# Altium schematic sheet ADC-Filter.SchDoc
size A4; SheetNumber: 12; SheetTotal: 12
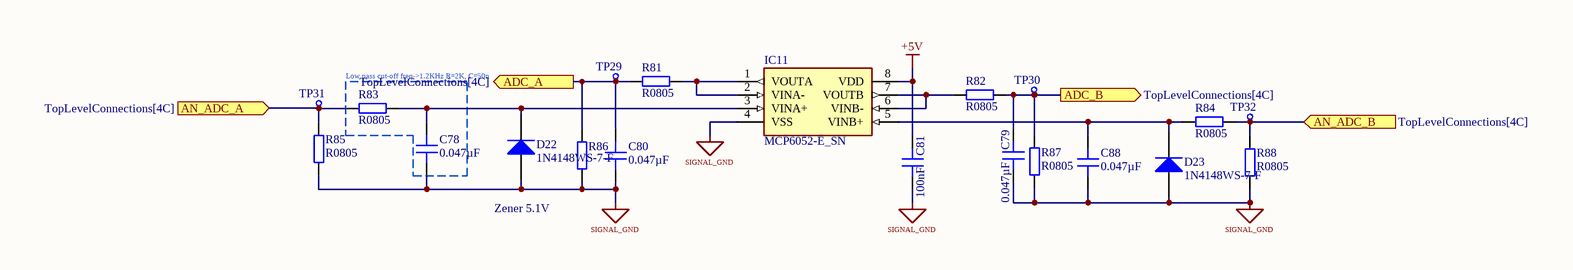
[diagram p0: ADC-Filter.SchDoc]

## Parts
C78  0.047µF  [CAP 0805_2012]
C79  0.047µF  [CAP 0805_2012]
C80  0.047µF  [CAP 0805_2012]
C81  value 100nF  [CAP 0805_2012]  (hidden comment: 0.1uF)
C88  0.047µF  [CAP 0805_2012]
D22  1N4148WS-7-F  [DIOD-SOD323-2-A_V]
D23  1N4148WS-7-F  [DIOD-SOD323-2-A_V]
IC11  MCP6052-E_SN  [SOIC127P600X175-8N]
R81  R0805  [RES_0805]
R82  R0805  [RES_0805]
R83  R0805  [RES_0805]
R84  R0805  [RES_0805]
R85  R0805  [RES_0805]
R86  R0805  [RES_0805]  (value not drawn)
R87  R0805  [RES_0805]
R88  R0805  [RES_0805]
TP29  TestPad  [Test Pad Small]  (value not drawn)
TP30  TestPad  [Test Pad Small]  (value not drawn)
TP31  TestPad  [Test Pad Small]  (value not drawn)
TP32  TestPad  [Test Pad Small]  (value not drawn)

## Blocks framed on the sheet
Low pass cut-off freq->1.2KHz R=2K, C=50n: C78 R83

## Ports
ADC_A (out, see TopLevelConnections[4C]), ADC_B (out, see TopLevelConnections[4C]), AN_ADC_A (in, see TopLevelConnections[4C]), AN_ADC_B (in, see TopLevelConnections[4C])

## Nets
+5V: C81.2 IC11.8(VDD)
SIGNAL_GND: C78.1 C79.1 C80.1 C81.1 C88.1 D22.1(A) D23.1(A) IC11.4(VSS) R85.1 R86.1 R87.2 R88.1
ADC_A: C80.2 R81.2 R86.2 TP29.P2 ; port ADC_A
ADC_B: C79.2 R82.1 R87.1 TP30.P2 ; port ADC_B
AN_ADC_A: R83.1 R85.2 TP31.P2 ; port AN_ADC_A
AN_ADC_B: R84.2 R88.2 TP32.P2 ; port AN_ADC_B
NetC78_2: C78.2 D22.2(K) IC11.3(VINA+) R83.2
NetC88_2: C88.2 D23.2(K) IC11.5(VINB+) R84.1
NetIC11_1: IC11.1(VOUTA) IC11.2(VINA-) R81.1
NetIC11_6: IC11.6(VINB-) IC11.7(VOUTB) R82.2

## Notes on the sheet
- Zener 5.1V
- Title:
- Author:
- Checked By:
- Approved:
- Size:
- Date:
- Git Hash:
- A4
- Prj:
- Variant:
- SW Version:
- Description:

## Library data of the parts
C78-C80 C88 = 08055F473K4T2A: CAP CER 0.047UF 50V X8R 0805; manufacturer: AVX Corporation; Tolerance: ±10%; Part Number: 08055F473K4T2A; Value: 0.047µF; Applications: Automotive; Capacitance: 0.047µF; componentlink1description: Datasheet; componentlink1url: http://datasheets.avx.com/AutoMLCC.pdf; componentlink2description: DigiKey Link; componentlink2url: http://digikey.com/product-detail/en/avx-corporation/08055F473K4T2A/478-3612-1-ND/1024965; Device Package: 0805 (2012 Metric); Features: High Temperature; lastupdated: 02/09/2020 01:04:39; Lifecycle Status: Active; Minimum Order: 1; Mounting Type: Surface Mount, MLCC; Operating Temperature: -55°C ~ 150°C; Package / Case: 0805 (2012 Metric); packaging: TapeAndReel; partid: 3914; Part Status: Active; price: 0.06; Ratings: AEC-Q200; series: -; Size / Dimension: 0.079" L x 0.049" W (2.01mm x 1.25mm); Supplier 1: DigiKey; Supplier Part Number 1: 478-3612-1-ND; Temperature Coefficient: X8R; Thickness (Max): 0.037" (0.94mm); Voltage - Rated: 50V
C81 = C2012X7R1A106K125AE: CAP CER 10UF 10V X7R 0805; manufacturer: TDK Corporation; Capacitance: 10 µF; Tolerance: ±10%; Part Number: C2012X7R1A106K125AE; Applications: Boardflex Sensitive; componentlink1description: Datasheet; componentlink1url: https://product.tdk.com/info/en/catalog/datasheets/mlcc_commercial_soft_en.pdf?ref_disty=digikey; componentlink2description: DigiKey Link; componentlink2url: https://www.digikey.com/en/products/detail/tdk-corporation/C2012X7R1A106K125AE/5809181; Device Package: 0805 (2012 Metric); Features: Soft Termination; lastupdated: 30/01/2024 20:15:17; Lifecycle Status: Active; Minimum Order: 1; Mounting Type: Surface Mount, MLCC; Operating Temperature: -55°C ~ 125°C; Package / Case: 0805 (2012 Metric); packaging: TapeAndReel; partid: 3036; Part Status: Active; price: 0.07; series: C; Size / Dimension: 0.079" L x 0.049" W (2.00mm x 1.25mm); Supplier 1: DigiKey; Supplier Part Number 1: 445-173616-1-ND; Temperature Coefficient: X7R; Thickness (Max): 0.059" (1.50mm); Voltage - Rated: 10V
D22 D23 = CMP-004-00002-2: Fast Switching Diode, 75 V, 0.3 A, -65 to 150 degC, 2-Pin SOD323, RoHS, Tape and Reel; Manufacturer: Diodes Inc; Peak Reverse Current: 1uA; Max Surge Current: 2A; Elements: 1; Forward Current: 300mA; Recovery Time: 4ns; Forward Voltage: 1.25V; Datasheet Version: Rev. 25-2, 03/2016; Case/Package: SOD; Min Operating Temperature: -65°C; RoHS Compliant: True; Max Operating Temperature: 150°C; Manufacturer URL: http://www.diodes.com/; Pins: 2; Package Quantity: 3000; Datasheet URL: http://www.diodes.com/datasheets/ds30097.pdf; Packaging: TapeandReel; Package Description: 2-Pin Small Outline Diode, Body 1.7 x 1.3 mm; Mounting Technology: SM; Package Reference: SOD323-2
IC11 = MCP6052-E_SN: Integrated Circuit; Manufacturer_Name: Microchip; Manufacturer_Part_Number: MCP6052-E/SN; Datasheet Link: http://ww1.microchip.com/downloads/en/DeviceDoc/MCP6051_DS22182B.pdf; Height: 1.75mm; Mouser Part Number: 579-MCP6052-E/SN; Mouser Price/Stock: https://www.mouser.com/Search/Refine.aspx?Keyword=579-MCP6052-E%2FSN
R81-R88 = RES_0805: Resistor SMD 0805; Manufacturer: *; Manufacturer Part Number: *; Distributor Link: *; LCSC: *